# Altium project THYRISTOR POWER REGULATOR_V2.PrjPCB
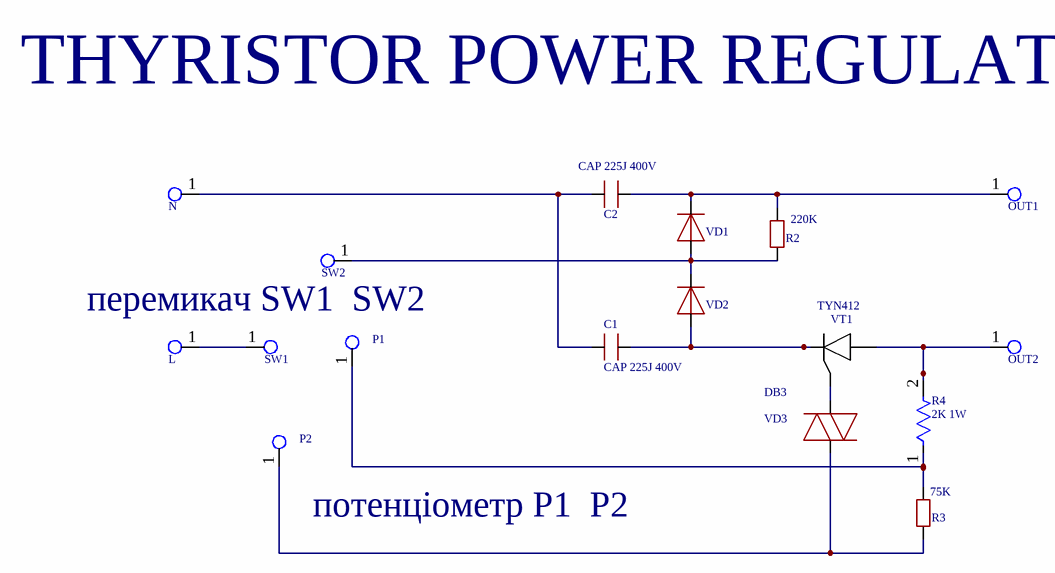
[diagram p0: THYRISTOR POWER REGULATOR_V2..SchDoc]
1 sheet, 17 parts. Net scope: global (net labels, ports and power ports of the same name join across sheets).
Board file: THYRISTOR POWER REGULATOR_V2..PcbDoc

## Sheet THYRISTOR POWER REGULATOR_V2..SchDoc
size A4

### Parts
C1  CAP 225J 400V  [CAP 225J 400V]
C2  CAP 225J 400V  [CAP 225J 400V]
L  Test_Point_PCB  [Test_Point]  (value not drawn)
N  Test_Point_PCB  [Test_Point]  (value not drawn)
OUT1  Test_Point_PCB  [Test_Point]  (value not drawn)
OUT2  Test_Point_PCB  [Test_Point]  (value not drawn)
P1  Test_Point_PCB  [Test_Point]  (value not drawn)
P2  Test_Point_PCB  [Test_Point]  (value not drawn)
R2  220K  [RES025W]
R3  75K  [RES025W]
R4  2K 1W  [RES-2W]
SW1  Test_Point_PCB  [Test_Point]  (value not drawn)
SW2  Test_Point_PCB  [Test_Point]  (value not drawn)
VD1  DIODE  [FR207]  (value not drawn)
VD2  DIODE  [FR207]  (value not drawn)
VD3  DB3  [DB3]
VT1  TYN412  [TO-220-3]

### Nets
NetC1_1: C1.1(C) VD2.2(A) VT1.1
NetC1_2: C1.2(A) C2.2(A) N.1(G9)
NetC2_1: C2.1(C) OUT1.1(G9) R2.2 VD1.1(C)
NetL_1: L.1(G9) SW1.1(G9)
NetOUT2_1: OUT2.1(G9) R4.2 VT1.2
NetP1_1: P1.1(G9) R3.2 R4.1
NetP2_1: P2.1(G9) R3.1 VD3.2(A)
NetR2_1: R2.1 SW2.1(G9) VD1.2(A) VD2.1(C)
NetVD3_1: VD3.1(C) VT1.3

### Notes on the sheet
- THYRISTOR POWER REGULATOR
- перемикач SW1  SW2
- (near P2) потенціометр P1  P2

### Library data of the parts
L N OUT1 OUT2 P1 P2 SW1 SW2 = TP_PCB?: Test_Point
R2 R3 = RES
R4 = RES-CONST: 10K
VD3 = DIODE